# EAGLE schematic MOL-v2-0 (EAGLE 8.2.2)
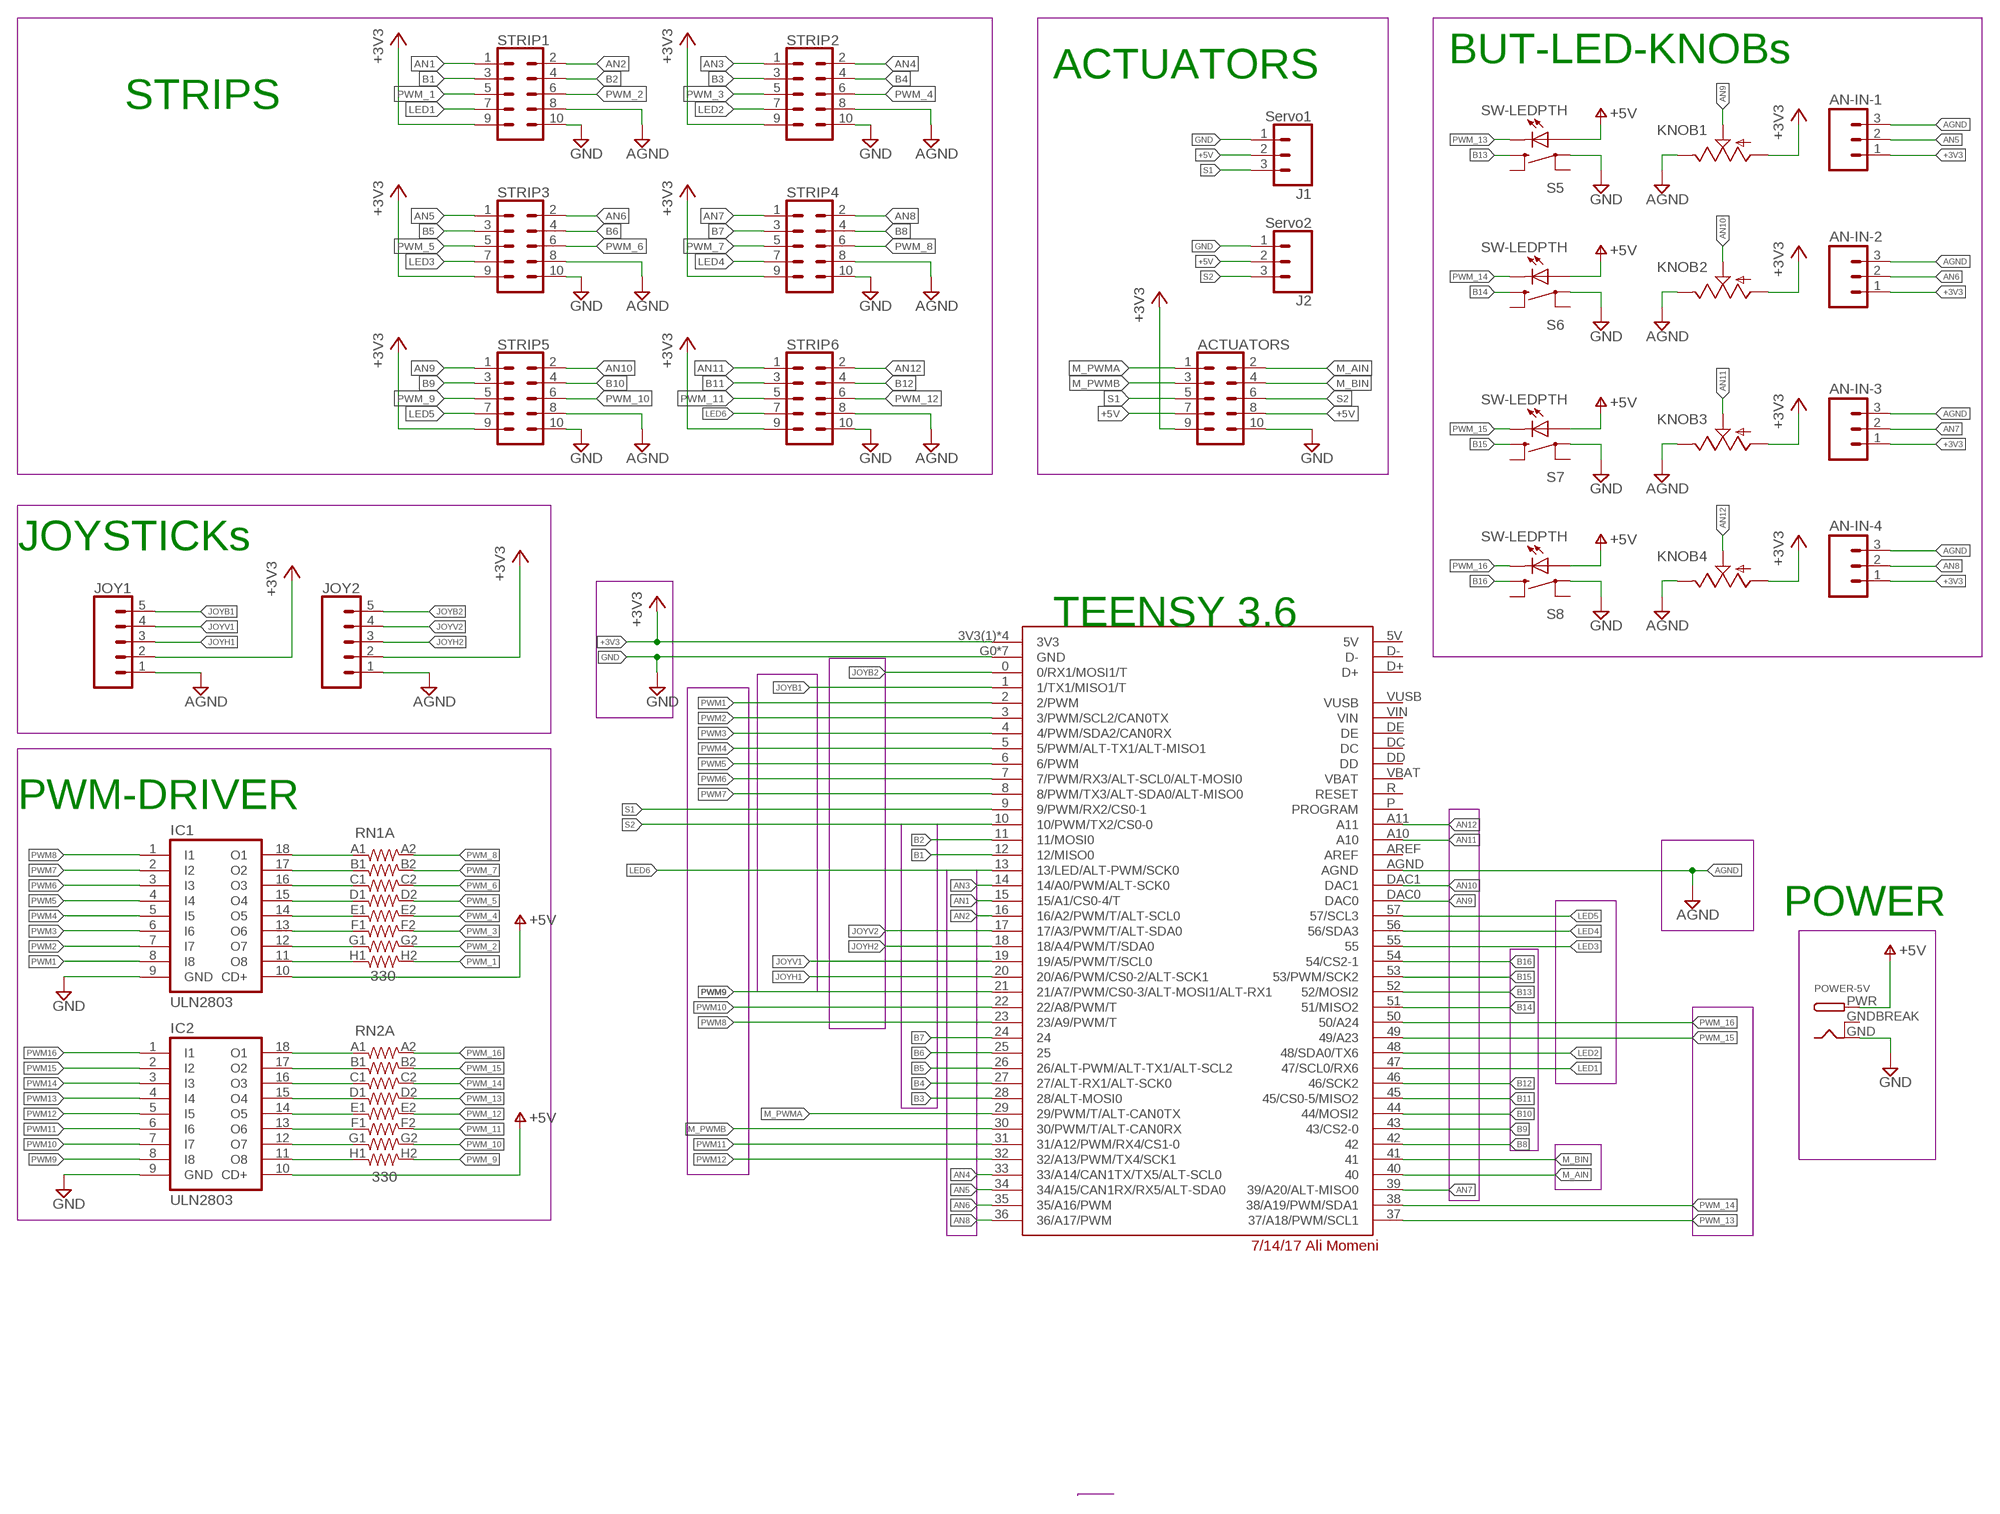
[diagram p0: schematic, sheet 1]

## Parts
ACTUATORS  CONN_05X2SHD_LOCK  [2X5-SHROUDED_LOCK]
AN-IN-1  M031X03_NO_SILK  [1X03_NO_SILK]
AN-IN-2  M031X03_NO_SILK  [1X03_NO_SILK]
AN-IN-3  M031X03_NO_SILK  [1X03_NO_SILK]
AN-IN-4  M031X03_NO_SILK  [1X03_NO_SILK]
IC1  ULN2803  ULN2803A  [DIL18]
IC2  ULN2803  ULN2803A  [DIL18]
J1  Servo1  CONN_03LOCK  [1X03_LOCK@1]
J2  Servo2  CONN_03LOCK  [1X03_LOCK@1]
JOY1  CONN_05LOCK  [1X05_LOCK]
JOY2  CONN_05LOCK  [1X05_LOCK]
KNOB1  TRIM  [TRIM-PCB-9MM]
KNOB2  TRIM  [TRIM-PCB-9MM]
KNOB3  TRIM  [TRIM-PCB-9MM]
KNOB4  TRIM  [TRIM-PCB-9MM]
POWER-5V  DCBARRELPTH  [DCJACK_2MM_PTH]
RN1  330  RESISTOR-NET-8PDIL16  [RESISTOR-NET-8P-DIL16]
RN2  330  RESISTOR-NET-8PDIL16  [RESISTOR-NET-8P-DIL16]
S5  SW-LEDPTH  [TR2-SWITCH-MOMENTARY-LED]
S6  SW-LEDPTH  [TR2-SWITCH-MOMENTARY-LED]
S7  SW-LEDPTH  [TR2-SWITCH-MOMENTARY-LED]
S8  SW-LEDPTH  [TR2-SWITCH-MOMENTARY-LED]
STRIP1  CONN_05X2SHD_LOCK  [2X5-SHROUDED_LOCK]
STRIP2  CONN_05X2SHD_LOCK  [2X5-SHROUDED_LOCK]
STRIP3  CONN_05X2SHD_LOCK  [2X5-SHROUDED_LOCK]
STRIP4  CONN_05X2SHD_LOCK  [2X5-SHROUDED_LOCK]
STRIP5  CONN_05X2SHD_LOCK  [2X5-SHROUDED_LOCK]
STRIP6  CONN_05X2SHD_LOCK  [2X5-SHROUDED_LOCK]
U$2  TEENSY3_6--ALLPINS  [T36]

## Nets
+3V3: ACTUATORS.9 AN-IN-1.1 AN-IN-2.1 AN-IN-3.1 AN-IN-4.1 JOY1.2 JOY2.2 KNOB1.1(A) KNOB2.1(A) KNOB3.1(A) KNOB4.1(A) STRIP1.9 STRIP2.9 STRIP3.9 STRIP4.9 STRIP5.9 STRIP6.9 U$2.3V3(1)(3V3) U$2.3V3(2)(3V3) U$2.3V3(3)(3V3) U$2.3V3(4)(3V3)
+5V [Power]: ACTUATORS.7 ACTUATORS.8 IC1.10(CD+) IC2.10(CD+) J1.2 J2.2 POWER-5V.PWR ; supply symbol labelled V+
AGND [Analog Sig]: AN-IN-1.3 AN-IN-2.3 AN-IN-3.3 AN-IN-4.3 JOY1.1 JOY2.1 KNOB1.3(E) KNOB2.3(E) KNOB3.3(E) KNOB4.3(E) STRIP1.8 STRIP2.8 STRIP3.8 STRIP4.8 STRIP5.8 STRIP6.8 U$2.AGND
AN1 [Analog Sig]: STRIP1.1 U$2.15(15/A1/CS0-4/T)
AN2 [Analog Sig]: STRIP1.2 U$2.16(16/A2/PWM/T/ALT-SCL0)
AN3 [Analog Sig]: STRIP2.1 U$2.14(14/A0/PWM/ALT-SCK0)
AN4 [Analog Sig]: STRIP2.2 U$2.33(33/A14/CAN1TX/TX5/ALT-SCL0)
AN5 [Analog Sig]: AN-IN-1.2 STRIP3.1 U$2.34(34/A15/CAN1RX/RX5/ALT-SDA0)
AN6 [Analog Sig]: AN-IN-2.2 STRIP3.2 U$2.35(35/A16/PWM)
AN7 [Analog Sig]: AN-IN-3.2 STRIP4.1 U$2.39(39/A20/ALT-MISO0)
AN8 [Analog Sig]: AN-IN-4.2 STRIP4.2 U$2.36(36/A17/PWM)
AN9 [Analog Sig]: KNOB1.2(S) STRIP5.1 U$2.DAC0
AN10 [Analog Sig]: KNOB2.2(S) STRIP5.2 U$2.DAC1
AN11 [Analog Sig]: KNOB3.2(S) STRIP6.1 U$2.A10
AN12 [Analog Sig]: KNOB4.2(S) STRIP6.2 U$2.A11
B1: STRIP1.3 U$2.12(12/MISO0)
B2: STRIP1.4 U$2.11(11/MOSI0)
B3: STRIP2.3 U$2.28(28/ALT-MOSI0)
B4: STRIP2.4 U$2.27(27/ALT-RX1/ALT-SCK0)
B5: STRIP3.3 U$2.26(26/ALT-PWM/ALT-TX1/ALT-SCL2)
B6: STRIP3.4 U$2.25
B7: STRIP4.3 U$2.24
B8: STRIP4.4 U$2.42
B9: STRIP5.3 U$2.43(43/CS2-0)
B10: STRIP5.4 U$2.44(44/MOSI2)
B11: STRIP6.3 U$2.45(45/CS0-5/MISO2)
B12: STRIP6.4 U$2.46(46/SCK2)
B13: S5.1 U$2.52(52/MOSI2)
B14: S6.1 U$2.51(51/MISO2)
B15: S7.1 U$2.53(53/PWM/SCK2)
B16: S8.1 U$2.54(54/CS2-1)
GND: ACTUATORS.10 IC1.9(GND) IC2.9(GND) J1.1 J2.1 POWER-5V.GND S5.3 S6.3 S7.3 S8.3 STRIP1.10 STRIP2.10 STRIP3.10 STRIP4.10 STRIP5.10 STRIP6.10 U$2.G0(GND) U$2.G1(GND) U$2.G2(GND) U$2.G3(GND) U$2.G4(GND) U$2.G5(GND) U$2.G6(GND)
JOYB1: JOY1.5 U$2.1(1/TX1/MISO1/T)
JOYB2: JOY2.5 U$2.0(0/RX1/MOSI1/T)
JOYH1 [Analog Sig]: JOY1.3 U$2.20(20/A6/PWM/CS0-2/ALT-SCK1)
JOYH2 [Analog Sig]: JOY2.3 U$2.18(18/A4/PWM/T/SDA0)
JOYV1 [Analog Sig]: JOY1.4 U$2.19(19/A5/PWM/T/SCL0)
JOYV2 [Analog Sig]: JOY2.4 U$2.17(17/A3/PWM/T/ALT-SDA0)
LED1: STRIP1.7 U$2.47(47/SCL0/RX6)
LED2: STRIP2.7 U$2.48(48/SDA0/TX6)
LED3: STRIP3.7 U$2.55
LED4: STRIP4.7 U$2.56(56/SDA3)
LED5: STRIP5.7 U$2.57(57/SCL3)
LED6: STRIP6.7 U$2.13(13/LED/ALT-PWM/SCK0)
M_AIN: ACTUATORS.2 U$2.40
M_BIN: ACTUATORS.4 U$2.41
M_PWMA: ACTUATORS.1 U$2.29(29/PWM/T/ALT-CAN0TX)
M_PWMB: ACTUATORS.3 U$2.30(30/PWM/T/ALT-CAN0RX)
N$11: IC1.18(O1) RN1.A1
N$12: IC1.17(O2) RN1.B1
N$13: IC1.16(O3) RN1.C1
N$14: IC1.15(O4) RN1.D1
N$15: IC1.14(O5) RN1.E1
N$16: IC1.13(O6) RN1.F1
N$17: IC1.12(O7) RN1.G1
N$18: IC1.11(O8) RN1.H1
N$19: IC2.18(O1) RN2.A1
N$20: IC2.17(O2) RN2.B1
N$21: IC2.16(O3) RN2.C1
N$22: IC2.15(O4) RN2.D1
N$23: IC2.14(O5) RN2.E1
N$24: IC2.12(O7) RN2.G1
N$25: IC2.11(O8) RN2.H1
N$26: IC2.13(O6) RN2.F1
PWM1: IC1.8(I8) U$2.2(2/PWM)
PWM2: IC1.7(I7) U$2.3(3/PWM/SCL2/CAN0TX)
PWM3: IC1.6(I6) U$2.4(4/PWM/SDA2/CAN0RX)
PWM4: IC1.5(I5) U$2.5(5/PWM/ALT-TX1/ALT-MISO1)
PWM5: IC1.4(I4) U$2.6(6/PWM)
PWM6: IC1.3(I3) U$2.7(7/PWM/RX3/ALT-SCL0/ALT-MOSI0)
PWM7: IC1.2(I2) U$2.8(8/PWM/TX3/ALT-SDA0/ALT-MISO0)
PWM8: IC1.1(I1) U$2.23(23/A9/PWM/T)
PWM9: IC2.8(I8) U$2.21(21/A7/PWM/CS0-3/ALT-MOSI1/ALT-RX1)
PWM10: IC2.7(I7) U$2.22(22/A8/PWM/T)
PWM11: IC2.6(I6) U$2.31(31/A12/PWM/RX4/CS1-0)
PWM12: IC2.5(I5) U$2.32(32/A13/PWM/TX4/SCK1)
PWM13: IC2.4(I4)
PWM14: IC2.3(I3)
PWM15: IC2.2(I2)
PWM16: IC2.1(I1)
PWM_1: RN1.H2 STRIP1.5
PWM_2: RN1.G2 STRIP1.6
PWM_3: RN1.F2 STRIP2.5
PWM_4: RN1.E2 STRIP2.6
PWM_5: RN1.D2 STRIP3.5
PWM_6: RN1.C2 STRIP3.6
PWM_7: RN1.B2 STRIP4.5
PWM_8: RN1.A2 STRIP4.6
PWM_9: RN2.H2 STRIP5.5
PWM_10: RN2.G2 STRIP5.6
PWM_11: RN2.F2 STRIP6.5
PWM_12: RN2.E2 STRIP6.6
PWM_13: RN2.D2 S5.C U$2.37(37/A18/PWM/SCL1)
PWM_14: RN2.C2 S6.C U$2.38(38/A19/PWM/SDA1)
PWM_15: RN2.B2 S7.C U$2.49(49/A23)
PWM_16: RN2.A2 S8.C U$2.50(50/A24)
S1: ACTUATORS.5 J1.3 U$2.9(9/PWM/RX2/CS0-1)
S2: ACTUATORS.6 J2.3 U$2.10(10/PWM/TX2/CS0-0)
V+: S5.A S6.A S7.A S8.A
Unconnected: S5.2 S5.4 S6.2 S6.4 S7.2 S7.4 S8.2 S8.4 U$2.5V U$2.AREF U$2.D+ U$2.D- U$2.DC U$2.DD U$2.DE U$2.P(PROGRAM) U$2.R(RESET) U$2.VBAT U$2.VIN U$2.VUSB

## Notes on the sheet
- BUT-LED-KNOBs
- ACTUATORS
- STRIPS
- JOYSTICKs
- TEENSY 3.6
- PWM-DRIVER
- POWER

## Power pins joined to a net without a drawn wire
GNDBREAK: POWER-5V.GNDBREAK

## Library data of the parts
ACTUATORS STRIP1-STRIP6 = SparkFun-Connectors:CONN_05X2: Multi connection point. Often used as Generic Header-pin footprint for 0.1 inch spaced/style header connections For AVR SPI programming port, see special device with nice symbol: "AVR_SPI_PROG_5x2.dev" You can populate with any combo of single row headers, but if you'd like an exact match, check these: 2x5 AVR ICSP Male Header <https://www.sparkfun.com/products/778> (PRT-00778) 2x5 Pin Shrouded Header <https://www.sparkfun.com/products/8506> (PRT-08506) On any of the 0.1 inch spaced packages, you can populate with these: Break Away Headers - Straight <https://www.sparkfun.com/products/116> (PRT-00116) Break Away Male Headers - Right Angle <https://www.sparkfun.com/products/553> (PRT-00553) Female Headers <https://www.sparkfun.com/products/115> (PRT-00115) Break Away Headers - Machine Pin <https://www.sparkfun.com/products/117> (PRT-00117) Break Away Female Headers - Swiss Machine Pin <https://www.sparkfun.com/products/743> (PRT-00743) Special note: the shrouded connector mates well with our 5x2 ribbon cables: 2x5 Pin IDC Ribbon Cable <https://www.sparkfun.com/products/8535> (PRT-08535); PROD_ID: CONN-08671; SF_ID: PRT-08506
AN-IN-1-AN-IN-4 = SparkFun-Connectors:M03: Header 3 Standard 3-pin 0.1" header. Use with straight break away headers (SKU : PRT-00116), right angle break away headers (PRT-00553), swiss pins (PRT-00743), machine pins (PRT-00117), and female headers (PRT-00115). Molex polarized connector foot print use with SKU : PRT-08232 with associated crimp pins and housings.
IC1 IC2 = uln-udn:ULN2803A: DRIVER ARRAY
J1 J2 = SparkFun-Connectors:CONN_03: Multi connection point. Often used as Generic Header-pin footprint for 0.1 inch spaced/style header connections On any of the 0.1 inch spaced packages, you can populate with these: Break Away Headers - Straight <https://www.sparkfun.com/products/116> (PRT-00116) Break Away Male Headers - Right Angle <https://www.sparkfun.com/products/553> (PRT-00553) Female Headers <https://www.sparkfun.com/products/115> (PRT-00115) Break Away Headers - Machine Pin <https://www.sparkfun.com/products/117> (PRT-00117) Break Away Female Headers - Swiss Machine Pin <https://www.sparkfun.com/products/743> (PRT-00743) Stackable Header - 3 Pin (Female, 0.1") <https://www.sparkfun.com/products/13875> (PRT-13875) For SCREWTERMINALS and SPRING TERMINALS visit here: Screw Terimnals on SparkFun.com <https://www.sparkfun.com/search/results?term=Screw+Terminals> (5mm/3.5mm/2.54mm spacing) This device is also useful as a general connection point to wire up your design to another part of your project. Our various solder wires solder well into these plated through hole pads. Hook-Up Wire - Assortment (Stranded, 22 AWG) <https://www.sparkfun.com/products/11375> (PRT-11375) Hook-Up Wire - Assortment (Solid Core, 22 AWG) <https://www.sparkfun.com/products/11367> (PRT-11367) View the entire wire category on our website here <https://www.sparkfun.com/categories/141> Special notes: Molex polarized connector foot print use with SKU : PRT-08232 with associated crimp pins and housings.
JOY1 JOY2 = SparkFun-Connectors:CONN_05: Multi connection point. Often used as Generic Header-pin footprint for 0.1 inch spaced/style header connections On any of the 0.1 inch spaced packages, you can populate with these: Break Away Headers - Straight <https://www.sparkfun.com/products/116> (PRT-00116) Break Away Male Headers - Right Angle <https://www.sparkfun.com/products/553> (PRT-00553) Female Headers <https://www.sparkfun.com/products/115> (PRT-00115) Break Away Headers - Machine Pin <https://www.sparkfun.com/products/117> (PRT-00117) Break Away Female Headers - Swiss Machine Pin <https://www.sparkfun.com/products/743> (PRT-00743) For SCREWTERMINALS and SPRING TERMINALS visit here: Screw Terimnals on SparkFun.com <https://www.sparkfun.com/search/results?term=Screw+Terminals> (5mm/3.5mm/2.54mm spacing) This device is also useful as a general connection point to wire up your design to another part of your project. Our various solder wires solder well into these plated through hole pads. Hook-Up Wire - Assortment (Stranded, 22 AWG) <https://www.sparkfun.com/products/11375> (PRT-11375) Hook-Up Wire - Assortment (Solid Core, 22 AWG) <https://www.sparkfun.com/products/11367> (PRT-11367) View the entire wire category on our website here <https://www.sparkfun.com/categories/141> Special notes: Molex polarized connector foot print use with SKU : PRT-08231 with associated crimp pins and housings. 1MM SMD Version SKU: PRT-10208
KNOB1-KNOB4 = Daniel:TRIM
POWER-5V = adafruit:DCBARREL: 2.0mm DC Barrel Jack DCJACK_2MM_PTH - Through Hole Jack (4UConnector: 05537)
RN1 RN2 = CMU-ArtFab:RESISTOR-NET-8P: CTS 742 Series 16 Terminations, 8 Resistors
S5-S8 = Daniel:SW-LED: SWITCH PUSH SPST-NO 10MA 12V
U$2 = CMU-ArtFab:TEENSY3_6--ALLPINS

## Net classes
2 Power: width 0.381 mm, clearance 0.279 mm
3 Analog Sig: width 0.381 mm, clearance 0.279 mm